# Altium schematic sheet WattmeterV1.1.SchDoc
size A4
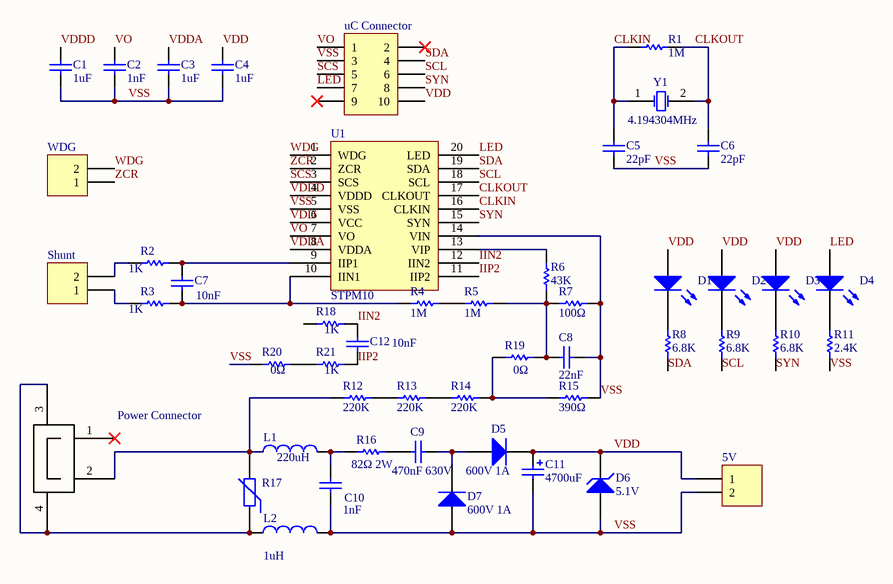
[diagram p0: WattmeterV1.1.SchDoc]

## Parts
5V  Header 2  [Female header 2x1]  (value not drawn)
C1  value 1uF  [Cap SMD 0603]  (hidden comment: Cap)
C2  value 1nF  [Cap SMD 0603]  (hidden comment: Cap)
C3  value 1uF  [Cap SMD 0603]  (hidden comment: Cap)
C4  value 1uF  [Cap SMD 0603]  (hidden comment: Cap)
C5  value 22pF  [Cap SMD 0603]  (hidden comment: Cap)
C6  value 22pF  [Cap SMD 0603]  (hidden comment: Cap)
C7  value 10nF  [Cap SMD 0603]  (hidden comment: Cap)
C8  value 22nF  [Cap SMD 0603]  (hidden comment: Cap)
C9  value 470nF 630V  [Cap Tenta MKP 470nF X2]  (hidden comment: Cap)
C10  value 1nF  [Cap SMD 0603]  (hidden comment: Cap)
C11  value 4700uF  [Cap Pol]  (hidden comment: Cap Pol2)
C12  value 10nF  [Cap SMD 0603]  (hidden comment: Cap)
D1  LED1  [LED Green]  (value not drawn)
D2  LED1  [LED Green]  (value not drawn)
D3  LED1  [LED Green]  (value not drawn)
D4  LED1  [LED Green]  (value not drawn)
D5  600V 1A  [Diode SMD]
D6  5.1V  [Diode SMD]
D7  600V 1A  [Diode SMD]
L1  value 220uH  [Inductor SMD]  (hidden comment: Inductor)
L2  value 1uH  [Inductor SMD]  (hidden comment: Inductor)
Power_Connector  Shunt Resistor  [Power Connector+ Shunt]  (value not drawn)
R1  value 1M  [res 0102]  (hidden comment: Res1)
R2  value 1K  [Res 0102]  (hidden comment: Res1)
R3  value 1K  [Res 0102]  (hidden comment: Res1)
R4  value 1M  [res 0102]  (hidden comment: Res1)
R5  value 1M  [res 0102]  (hidden comment: Res1)
R6  value 43K  [res 0102]  (hidden comment: Res1)
R7  value 100Ω  [res 0102]  (hidden comment: Res1)
R8  value 6.8K  [RES SMD 0603]  (hidden comment: Res1)
R9  value 6.8K  [RES SMD 0603]  (hidden comment: Res1)
R10  value 6.8K  [RES SMD 0603]  (hidden comment: Res1)
R11  value 2.4K  [RES SMD 0603]  (hidden comment: Res1)
R12  value 220K  [Res Vertical]  (hidden comment: Res1)
R13  value 220K  [Res Vertical]  (hidden comment: Res1)
R14  value 220K  [Res Vertical]  (hidden comment: Res1)
R15  value 390Ω  [Res 0102]  (hidden comment: Res1)
R16  value 82Ω 2W  [Res 0.7in]  (hidden comment: Res1)
R17  Res Varistor  [Varistor]  (value not drawn)
R18  value 1K  [Res SMD 0102]  (hidden comment: Res1)
R19  value 0Ω  [RES SMD 0603]  (hidden comment: Res1)
R20  value 0Ω  [RES SMD 0603]  (hidden comment: Res1)
R21  value 1K  [Res SMD 0102]  (hidden comment: Res1)
Shunt  Header 2  [HDR1X2]  (value not drawn)
U1  STPM10  [STPM10]
uC_Connector  Header 5X2  [Male Header 2x5]  (value not drawn)
WDG  Header 2  [Female header 2x1]  (value not drawn)
Y1  4.194304MHz  [Xtal]

## Nets
CLKIN: C5.2 R1.1 U1.16(CLKIN) Y1.1(OSC1)
CLKOUT: C6.2 R1.2 U1.17(CLKOUT) Y1.2(OSC2)
IIN2: C12.2 R18.2 U1.12(IIN2)
IIP2: C12.1 R21.2 U1.11(IIP2)
LED: D4.1(A) U1.20(LED) uC_Connector.7
SCL: R9.1 U1.18(SCL) uC_Connector.6
SCS: U1.3(SCS) uC_Connector.5
SDA: R8.1 U1.19(SDA) uC_Connector.4
SYN: R10.1 U1.15(SYN) uC_Connector.8
VDD: 5V.1 C4.2 C11.1 D1.1(A) D2.1(A) D3.1(A) D5.2(K) D6.2(K) U1.6(VCC) uC_Connector.10
VDDA: C3.2 U1.8(VDDA)
VDDD: C1.2 U1.4(VDDD)
VO: C2.2 U1.7(VO) uC_Connector.1
VSS: 5V.2 C1.1 C2.1 C3.1 C4.1 C5.1 C6.1 C8.2 C10.1 C11.2 D6.1(A) D7.1(A) L2.2 R7.2 R11.1 R15.2 R20.1 U1.5(VSS) U1.14(VIN) uC_Connector.3
WDG: U1.1(WDG) WDG.2
ZCR: U1.2(ZCR) WDG.1
NetC7_1: C7.1 R3.2 R4.1 U1.10(IIN1)
NetC7_2: C7.2 R2.2 U1.9(IIP1)
NetC8_1: C8.1 R5.2 R6.1 R7.1 R19.2
NetC9_1: C9.1 D5.1(A) D7.2(K)
NetC9_2: C9.2 R16.2
NetC10_2: C10.2 L1.2 R16.1
NetD1_2: D1.2(K) R8.2
NetD2_2: D2.2(K) R9.2
NetD3_2: D3.2(K) R10.2
NetD4_2: D4.2(K) R11.2
NetL1_1: L1.1 Power_Connector.2 R12.1 R17.2
NetL2_1: L2.1 Power_Connector.3 Power_Connector.4 R17.1
NetR2_1: R2.1 Shunt.2
NetR3_1: R3.1 Shunt.1
NetR4_2: R4.2 R5.1
NetR6_2: R6.2 U1.13(VIP)
NetR12_2: R12.2 R13.1
NetR13_2: R13.2 R14.1
NetR14_2: R14.2 R15.1 R19.1
NetR20_2: R20.2 R21.1

Not connected (* = marked no-connect by the designer): Power_Connector 1*; R18 1; uC_Connector 2* 9*

## Library data of the parts
5V Shunt WDG = Header 2: Header, 2-Pin; LatestRevisionDate: 17-Jul-2002; LatestRevisionNote: Re-released for DXP Platform.; Publisher: Altium Limited
C1-C10 C12 = Cap: Capacitor; Published: 8-Jun-2000; LatestRevisionDate: 17-Jul-2002; LatestRevisionNote: Re-released for DXP Platform.; PackageReference: RAD-0.3; Publisher: Altium Limited; PackageDescription: Radial Cap, Thru-Hole; 2 Leads; 0.3 in Pin Spacing
C11 = Cap Pol2: Polarized Capacitor (Axial); Published: 8-Jun-2000; LatestRevisionDate: 17-Jul-2002; LatestRevisionNote: Re-released for DXP Platform.; PackageReference: POLAR0.8; Publisher: Altium Limited; PackageDescription: Polarized Capacitor; 2 Leads
D1-D4 = LED1: Typical RED GaAs LED; Published: 8-Jun-2000; LatestRevisionDate: 08-Jul-2005; LatestRevisionNote: Mech Layer 1 removed.; PackageReference: LED-1; Publisher: Altium Limited; PackageDescription: LED; 2 Leads
D5 D7 = Diode 1N4448: High Conductance Fast Diode; Published: 8-Jun-2000; LatestRevisionDate: 17-Jul-2002; LatestRevisionNote: Re-released for DXP Platform.; DatasheetVersion: 1997; PackageReference: DO-35; Publisher: Altium Limited; PackageDescription: Diode, Axial; Body 3.8 x 1.9 mm (LxDia. max), Lead Dia. 0.53 mm (max); Code_JEDEC: DO-204-AH; ComponentLink1Description: Manufacturer Link; ComponentLink1URL: http://www.fairchildsemi.com/; ComponentLink2Description: Datasheet; ComponentLink2URL: http://www.fairchildsemi.com/ds/1N%2F1N4448.pdf
D6 = D Zener: Zener Diode; Published: 8-Jun-2000; LatestRevisionDate: 17-Jul-2002; LatestRevisionNote: Re-released for DXP Platform.; PackageReference: DIODE-0.7; Publisher: Altium Limited; PackageDescription: Diode, Thru-Hole; 2 Leads; 0.7 in Pin Spacing
L1 L2 = Inductor: Code_IEC: 1005; Published: 8-Jun-2000; LatestRevisionDate: 29-May-2009; LatestRevisionNote: IPC-7351 Footprint Added.; PackageReference: 0402-A; Publisher: Altium Limited; PackageDescription: Chip Inductor; Code_JEITA: 0402
R1-R16 R18-R21 = Res1: Resistor; Published: 8-Jun-2000; LatestRevisionDate: 17-Jul-2002; LatestRevisionNote: Re-released for DXP Platform.; PackageReference: AXIAL-0.3; Publisher: Altium Limited; PackageDescription: Axial Device, Thru-Hole; 2 Leads; 0.3 in Pin Spacing
R17 = Res Varistor: Varistor (Voltage-Sensitive Resistor); Published: 24-Mar-1999; LatestRevisionDate: 29-May-2009; LatestRevisionNote: IPC-7351 Footprint Added.; PackageVersion: Mar-2003; PackageReference: 6-0805; Publisher: Altium Limited; PackageDescription: Chip Resistor 0805 Case Size; Code_IPC: RESC2012
uC_Connector = Header 5X2: Header, 5-Pin, Dual row; LatestRevisionDate: 17-Jul-2002; LatestRevisionNote: Re-released for DXP Platform.; Publisher: Altium Limited
Y1 = XTAL: Crystal Oscillator; Published: 8-Jun-2000; LatestRevisionDate: 17-Jul-2002; LatestRevisionNote: Re-released for DXP Platform.; PackageReference: R38; Publisher: Altium Limited; PackageDescription: Crystal, Thru-Hole; 2 Leads; Body 3.1 x 8.2 mm (Dia.xH)